# Altium project ATmega1284p_breakout.PrjPcb
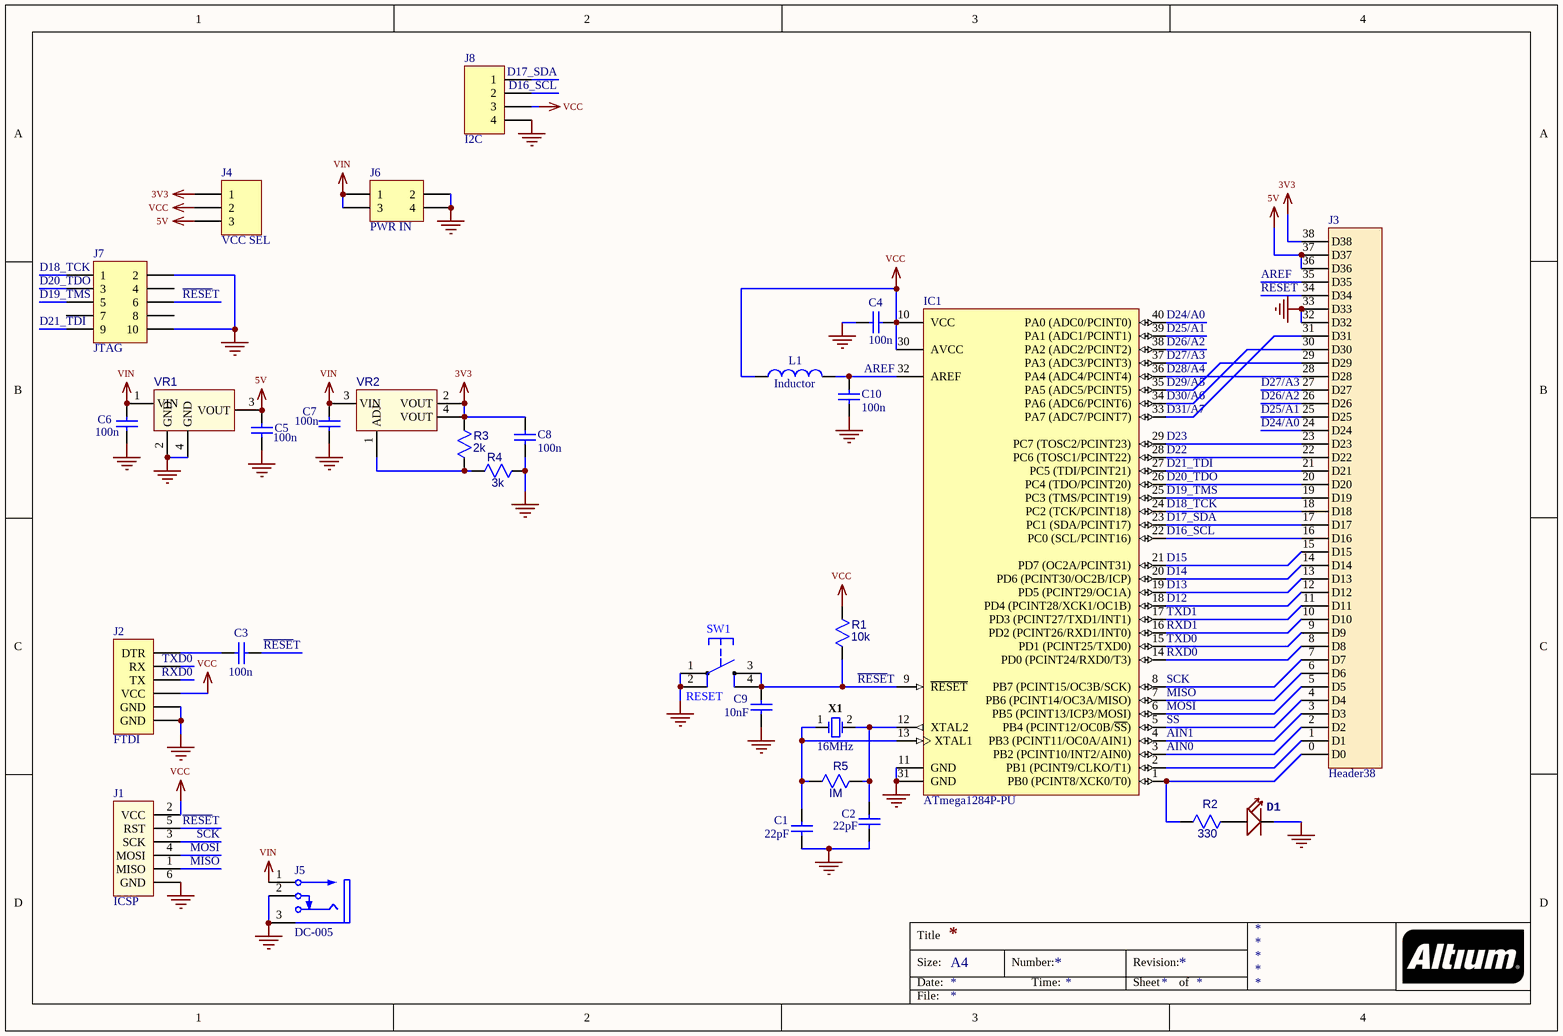
[diagram p0: ATmega1284p_breakout.SchDoc]
1 sheet, 30 parts. Net scope: global (net labels, ports and power ports of the same name join across sheets).
Board file: ATmega1284p_breakout.PcbDoc

## Sheet ATmega1284p_breakout.SchDoc
size A4

### Parts
C1  value 22pF  [RESC0805(2012)_M]  (hidden comment: Cap Semi)
C2  value 22pF  [RESC0805(2012)_M]  (hidden comment: Cap Semi)
C3  value 100n  [RESC0805(2012)_M]  (hidden comment: Cap Semi)
C4  value 100n  [RESC0805(2012)_M]  (hidden comment: Cap Semi)
C5  value 100n  [RESC0805(2012)_M]  (hidden comment: Cap Semi)
C6  value 100n  [RESC0805(2012)_M]  (hidden comment: Cap Semi)
C7  value 100n  [RESC0805(2012)_M]  (hidden comment: Cap Semi)
C8  value 100n  [RESC0805(2012)_M]  (hidden comment: Cap Semi)
C9  value 10nF  [RESC0805(2012)_M]  (hidden comment: Cap Semi)
C10  value 100n  [RESC0805(2012)_M]  (hidden comment: Cap Semi)
D1  LED  [LED-0805]  (value not drawn)
IC1  ATmega1284P-PU  [40P6]
J1  ICSP  [ICSP]
J2  FTDI  [HDR1X6]
J3  Header38  [Header38]
J4  VCC SEL  [HDR1X3]
J5  DC-005  [DCJ3P-14.2X11.0X9.0MM]
J6  PWR IN  [HDR2X2]
J7  JTAG  [HDR2X5]
J8  I2C  [HDR1X4]
L1  Inductor  [2029]
R1  value 10k  [CAPC0805(2012)75_N]  (hidden comment: RES_0805)
R2  value 330  [CAPC0805(2012)75_N]  (hidden comment: RES_0805)
R3  value 2k  [CAPC0805(2012)75_N]  (hidden comment: RES_0805)
R4  value 3k  [CAPC0805(2012)75_N]  (hidden comment: RES_0805)
R5  value IM  [CAPC0805(2012)75_N]  (hidden comment: RES_0805)
SW1  RESET  [TACT_SW]
VR1  LDL1117S50R  [SOT223_M]  (value not drawn)
VR2  LM117  [SOT223_M]  (value not drawn)
X1  16MHz  [Crystal]

### Nets
3V3: C8.2 J3.38(D38) J4.1 R3.2 VR2.2(VOUT) VR2.4(VOUT)
5V: C5.2 J3.36(D36) J3.37(D37) J4.3 VR1.3(VOUT)
GND: C1.1 C2.1 C4.1 C5.1 C6.1 C7.1 C8.1 C9.1 C10.1 D1.- IC1.11(GND) IC1.31(GND) J1.6(GND) J2.5(GND) J2.6(GND) J3.32(D32) J3.33(D33) J5.2 J5.3 J6.2 J6.4 J7.2 J7.10 J8.4 R4.1 SW1.1 SW1.2 VR1.2(GND) VR1.4(GND)
VCC: C4.2 IC1.10(VCC) IC1.30(AVCC) J1.2(VCC) J2.4(VCC) J4.2 J8.3 L1.1 R1.2
VIN: C6.2 C7.2 J5.1 J6.1 J6.3 VR1.1(VIN) VR2.3(VIN)
~{RESE}T: C3.2 C9.2 IC1.9(~{RESET}) J1.5(RST) J3.34(D34) J7.6 R1.1 SW1.3 SW1.4
~{S}S: IC1.5(PB4_(PCINT12/OC0B/~{SS})) J3.4(D4)
AIN0: IC1.3(PB2_(PCINT10/INT2/AIN0)) J3.2(D2)
AIN1: IC1.4(PB3_(PCINT11/OC0A/AIN1)) J3.3(D3)
AREF: C10.2 IC1.32(AREF) J3.35(D35) L1.2
D12: IC1.18(PD4_(PCINT28/XCK1/OC1B)) J3.12(D12)
D13: IC1.19(PD5_(PCINT29/OC1A)) J3.13(D13)
D14: IC1.20(PD6_(PCINT30/OC2B/ICP)) J3.14(D14)
D15: IC1.21(PD7_(OC2A/PCINT31)) J3.15(D15)
D16_SCL: IC1.22(PC0_(SCL/PCINT16)) J3.16(D16) J8.2
D17_SDA: IC1.23(PC1_(SDA/PCINT17)) J3.17(D17) J8.1
D18_TCK: IC1.24(PC2_(TCK/PCINT18)) J3.18(D18) J7.1
D19_TMS: IC1.25(PC3_(TMS/PCINT19)) J3.19(D19) J7.5
D20_TDO: IC1.26(PC4_(TDO/PCINT20)) J3.20(D20) J7.3
D21_TDI: IC1.27(PC5_(TDI/PCINT21)) J3.21(D21) J7.9
D22: IC1.28(PC6_(TOSC1/PCINT22)) J3.22(D22)
D23: IC1.29(PC7_(TOSC2/PCINT23)) J3.23(D23)
D24/A0: IC1.40(PA0_(ADC0/PCINT0)) J3.24(D24)
D25/A1: IC1.39(PA1_(ADC1/PCINT1)) J3.25(D25)
D26/A2: IC1.38(PA2_(ADC2/PCINT2)) J3.26(D26)
D27/A3: IC1.37(PA3_(ADC3/PCINT3)) J3.27(D27)
D28/A4: IC1.36(PA4_(ADC4/PCINT4)) J3.28(D28)
D29/A5: IC1.35(PA5_(ADC5/PCINT5)) J3.29(D29)
D30/A6: IC1.34(PA6_(ADC6/PCINT6)) J3.30(D30)
D31/A7: IC1.33(PA7_(ADC7/PCINT7)) J3.31(D31)
MISO: IC1.7(PB6_(PCINT14/OC3A/MISO)) J1.1(MISO) J3.6(D6)
MOSI: IC1.6(PB5_(PCINT13/ICP3/MOSI)) J1.4(MOSI) J3.5(D5)
RXD0: IC1.14(PD0_(PCINT24/RXD0/T3)) J2.3(TX) J3.8(D8)
RXD1: IC1.16(PD2_(PCINT26/RXD1/INT0)) J3.10(D10)
SCK: IC1.8(PB7_(PCINT15/OC3B/SCK)) J1.3(SCK) J3.7(D7)
TXD0: IC1.15(PD1_(PCINT25/TXD0)) J2.2(RX) J3.9(D9)
TXD1: IC1.17(PD3_(PCINT27/TXD1/INT1)) J3.11(D11)
NetC1_2: C1.2 IC1.13(XTAL1) R5.2 X1.1
NetC2_2: C2.2 IC1.12(XTAL2) R5.1 X1.2
NetC3_1: C3.1 J2.1(DTR)
NetD1_+: D1.+ R2.1
NetIC1_1: IC1.1(PB0_(PCINT8/XCK0/T0)) J3.0(D0) R2.2
NetIC1_2: IC1.2(PB1_(PCINT9/CLKO/T1)) J3.1(D1)
NetR3_1: R3.1 R4.2 VR2.1(ADJ)

Not connected (* = marked no-connect by the designer): J7 4 7 8

### Notes on the sheet
- Title
- Size:
- Date:
- A4
- Number:
- Time:
- Revision:
- Sheet
- of
- File:

### Library data of the parts
C1-C10 = Cap Semi: Capacitor (Semiconductor SIM Model); PackageReference: C1206; PackageDescription: Chip Capacitor
D1 = SMD-LED-CLEAR-RED(0805): MPN: 17-215SURC/S530-A2/TR8
IC1 = ATmega1284P-PU: 8-bit AVR Microcontroller, 128KB Flash, 4KB EEPROM, 16KB SRAM, 40-pin PDIP, Industrial Grade (-40°C to 85°C); DatasheetVersion: revC, Jun-2011; PackageVersion: revB, Sep-2001; PackageReference: 40P6; PackageDescription: 40-lead (0.600"/15.24mm Wide) Plastic Dual Inline Package (PDIP); Code_JEDEC: MS-011-AC; ComponentLink1Description: Manufacturer URL; ComponentLink1URL: http://www.atmel.com/; ComponentLink2Description: ATmega164A/164PA/324A/324PA/644A/644PA/1284/1284P Datasheet; ComponentLink2URL: http://www.atmel.com/dyn/resources/prod_documents/doc8272.pdf; ComponentLink3Description: ATmega164A/164PA/324A/324PA/644A/644PA/1284/1284P Summary; ComponentLink3URL: http://www.atmel.com/dyn/resources/prod_documents/8272S.pdf
J1 = ICSP: In-Circuit Serial Programming Header
J2 = MHDR1X6: Header, 6-Pin; LatestRevisionDate: 17-Jul-2002; LatestRevisionNote: Re-released for DXP Platform.; Publisher: Altium Limited
J3 = Component_1
J4 = Header 3: Header, 3-Pin; LatestRevisionDate: 17-Jul-2002; LatestRevisionNote: Re-released for DXP Platform.; Publisher: Altium Limited
J5 = DC BARREL
J6 = Header 2X2: Header, 2-Pin, Dual row; LatestRevisionDate: 17-Jul-2002; LatestRevisionNote: Re-released for DXP Platform.; Publisher: Altium Limited
J7 = Header 5X2: Header, 5-Pin, Dual row; LatestRevisionDate: 17-Jul-2002; LatestRevisionNote: Re-released for DXP Platform.; Publisher: Altium Limited
J8 = Header 4: Header, 4-Pin; LatestRevisionDate: 17-Jul-2002; LatestRevisionNote: Re-released for DXP Platform.; Publisher: Altium Limited
L1 = Inductor: Code_IEC: 1005; Value: 10mH; Published: 8-Jun-2000; LatestRevisionDate: 29-May-2009; LatestRevisionNote: IPC-7351 Footprint Added.; PackageReference: 0402-A; Publisher: Altium Limited; PackageDescription: Chip Inductor; Code_JEITA: 0402
SW1 = TACT_SW
VR1 = LM317: Fixed 5V Voltage Regulator; MFR: TI; MPN: LM340MP-5.0; ComponentLink1URL: http://www.ti.com/general/docs/lit/getliterature.tsp?genericPartNumber=tlv1117-50&fileType=pdf; ComponentLink1Description: Datasheet
VR2 = LM317: Adjustable Voltage Regulator; MFR: TI; MPN: LM340MP-5.0; ComponentLink1URL: http://www.ti.com/general/docs/lit/getliterature.tsp?genericPartNumber=tlv1117-50&fileType=pdf; ComponentLink1Description: Datasheet
X1 = XTAL-HC